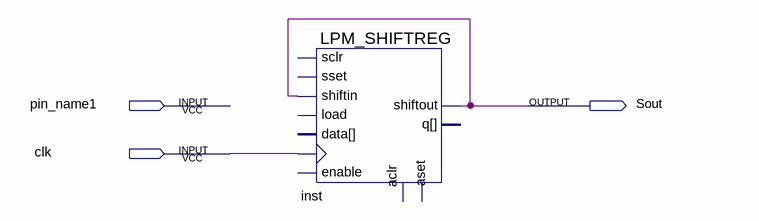
[diagram p0: schematic sheet]
// Quartus schematic pulseSequencer.bdf as structural Verilog: 1 symbols, 3 pins
module pulseSequencer (
  input  pin_name1,
  input  clk,
  output Sout
);

  LPM_SHIFTREG inst (
    .shiftin(Sout), .clock(clk), .shiftout(Sout));  // open: sset, enable, data, load, sclr, aset, aclr, q
endmodule
